# EAGLE design BG LWOC 2.1 (EAGLE 9.6.2)

## Sheet 1 of 4: POWER + HARDWARE
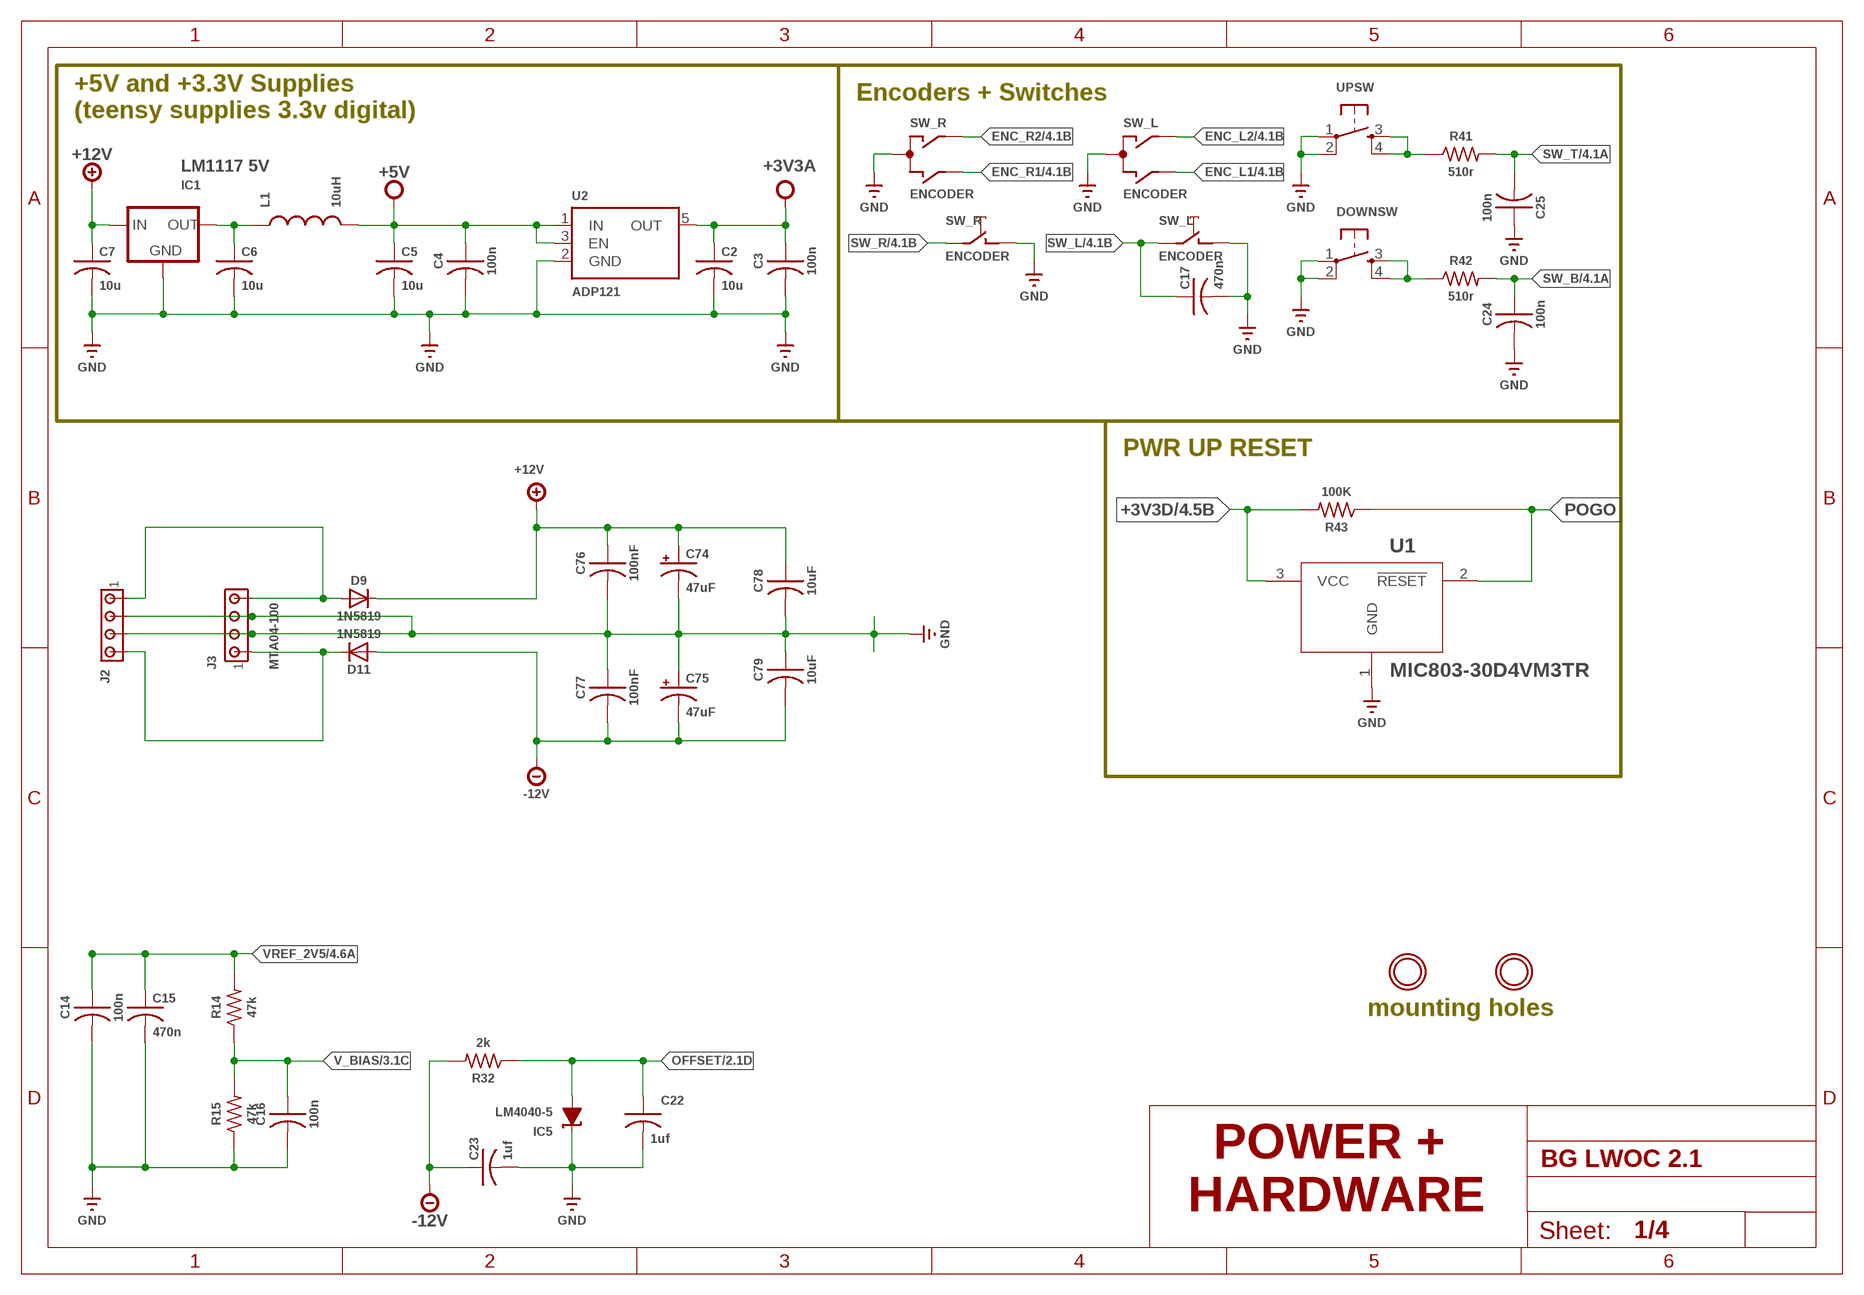
[diagram p0: schematic, sheet 1]

### Parts
C2  10u  C-USC1206K  [C1206K]
C3  100n  RCL_C-USC0603K  [RCL_C0603K]
C4  100n  RCL_C-USC0603K  [RCL_C0603K]
C5  10u  C-USC1206K  [C1206K]
C6  10u  C-USC1206K  [C1206K]
C7  10u  C-USC1206K  [C1206K]
C14  100n  RCL_C-USC0603K  [RCL_C0603K]
C15  470n  RCL_C-USC0603K  [RCL_C0603K]
C16  100n  RCL_C-USC0603K  [RCL_C0603K]
C17  470n  C-USC0805K  [C0805K]
C22  1uf  C-USC0805K  [C0805K]
C23  1uf  C-USC0805K  [C0805K]
C24  100n  RCL_C-USC0603K  [RCL_C0603K]
C25  100n  RCL_C-USC0603K  [RCL_C0603K]
C74  47uF  RCL_CPOL-USE2.5-6  [RCL_E2,5-6]
C75  47uF  RCL_CPOL-USE2.5-6  [RCL_E2,5-6]
C76  100nF  RCL_C-USC0603K  [RCL_C0603K]
C77  100nF  RCL_C-USC0603K  [RCL_C0603K]
C78  10uF  RCL_C-USC1210  [RCL_C1210]
C79  10uF  RCL_C-USC1210  [RCL_C1210]
D9  1N5819  DIODE_DIODE-SOD323-W  [DIODE_SOD323-W]
D11  1N5819  DIODE_DIODE-SOD323-W  [DIODE_SOD323-W]
DOWNSW  SPARKFUN_TAC_SWITCHPTH  [SPARKFUN_TACTILE-PTH]
IC1  LM1117 5V  LM1117TO252  [TO252]
IC5  LM4040-5  LM4041A12DBZ  [DBZ_R-PDSO-G3]
J2  MTA04-156  [1X4MTA]
J3  MTA04-100  [1X04MTA]
L1  10uH  INDUCTOR1210  [1210]
R14  47k  RCL_R-US_R0603  [RCL_R0603]
R15  47k  RCL_R-US_R0603  [RCL_R0603]
R32  2k  RCL_R-US_R0603  [RCL_R0603]
R41  510r  RCL_R-US_R0603  [RCL_R0603]
R42  510r  RCL_R-US_R0603  [RCL_R0603]
R43  100K  RCL_R-US_R0603  [RCL_R0603]
SW_L  ENCODER  OG-ENCODER_EC12E_SW  [OG-ENCODER_ALPS_EC12E_SW]
SW_R  ENCODER  OG-ENCODER_EC12E_SW  [OG-ENCODER_ALPS_EC12E_SW]
U1  MIC803-30D4VM3TR  [SOT95P232X110-3N]
U2  ADP121  [SOT23-5]
U$23  MOUNTINGHOLE2.5  [MOUNTINGHOLE_2.5_PLATED]
U$26  MOUNTINGHOLE2.5  [MOUNTINGHOLE_2.5_PLATED]
UPSW  SPARKFUN_TAC_SWITCHPTH  [SPARKFUN_TACTILE-PTH]

### Nets
+3V3A: C2.1 C3.1 U2.5(OUT) ; also sheet 2,4
+3V3D: R43.2 U1.3(VCC) ; also sheet 4
+5V: C4.1 C5.1 L1.2 U2.1(IN) U2.3(EN) ; also sheet 4
+12V: C7.1 C74.+ C76.1 C78.1 D9.C IC1.2(IN) ; also sheet 3
-12V: C23.1 C75.- C77.2 C79.2 D11.A R32.2 ; also sheet 3
ENC_L1: SW_L.B ; also sheet 4
ENC_L2: SW_L.A ; also sheet 4
ENC_R1: SW_R.B ; also sheet 4
ENC_R2: SW_R.A ; also sheet 4
GND: C2.2 C3.2 C4.2 C5.2 C6.2 C7.2 C14.2 C15.2 C16.2 C17.2 C22.2 C23.2 C24.2 C25.1 C74.- C75.+ C76.2 C77.1 C78.2 C79.1 DOWNSW.1 DOWNSW.2 IC1.1(GND) IC5.1(C) J2.2 J2.3 J3.2 J3.3 R15.1 SW_L.C SW_L.D SW_R.C SW_R.D U1.1(GND) U2.2(GND) UPSW.1 UPSW.2 ; also sheet 2,3,4
N$2: C6.1 IC1.3(OUT) L1.1
N$22: DOWNSW.3 DOWNSW.4 R42.1
N$26: R41.1 UPSW.3 UPSW.4
N$196: D11.C J2.4 J3.4
N$263: D9.A J2.1 J3.1
OFFSET: C22.1 IC5.2(A) R32.1 ; also sheet 2
POGO: R43.1 U1.2(!RESET!)
SW_B: C24.1 R42.2 ; also sheet 4
SW_L: C17.1 SW_L.E ; also sheet 4
SW_R: SW_R.E ; also sheet 4
SW_T: C25.2 R41.2 ; also sheet 4
V_BIAS: C16.1 R14.1 R15.2 ; also sheet 3
VREF_2V5: C14.1 C15.1 R14.2 ; also sheet 4
Unconnected: SW_L.GND1(G) SW_L.GND2(G) SW_R.GND1(G) SW_R.GND2(G)

### Notes on the sheet
- Encoders + Switches
- +5V and +3.3V Supplies
  (teensy supplies 3.3v digital)
- PWR UP RESET
- mounting holes
- POWER + 
  HARDWARE

## Sheet 2 of 4: INPUT STAGES
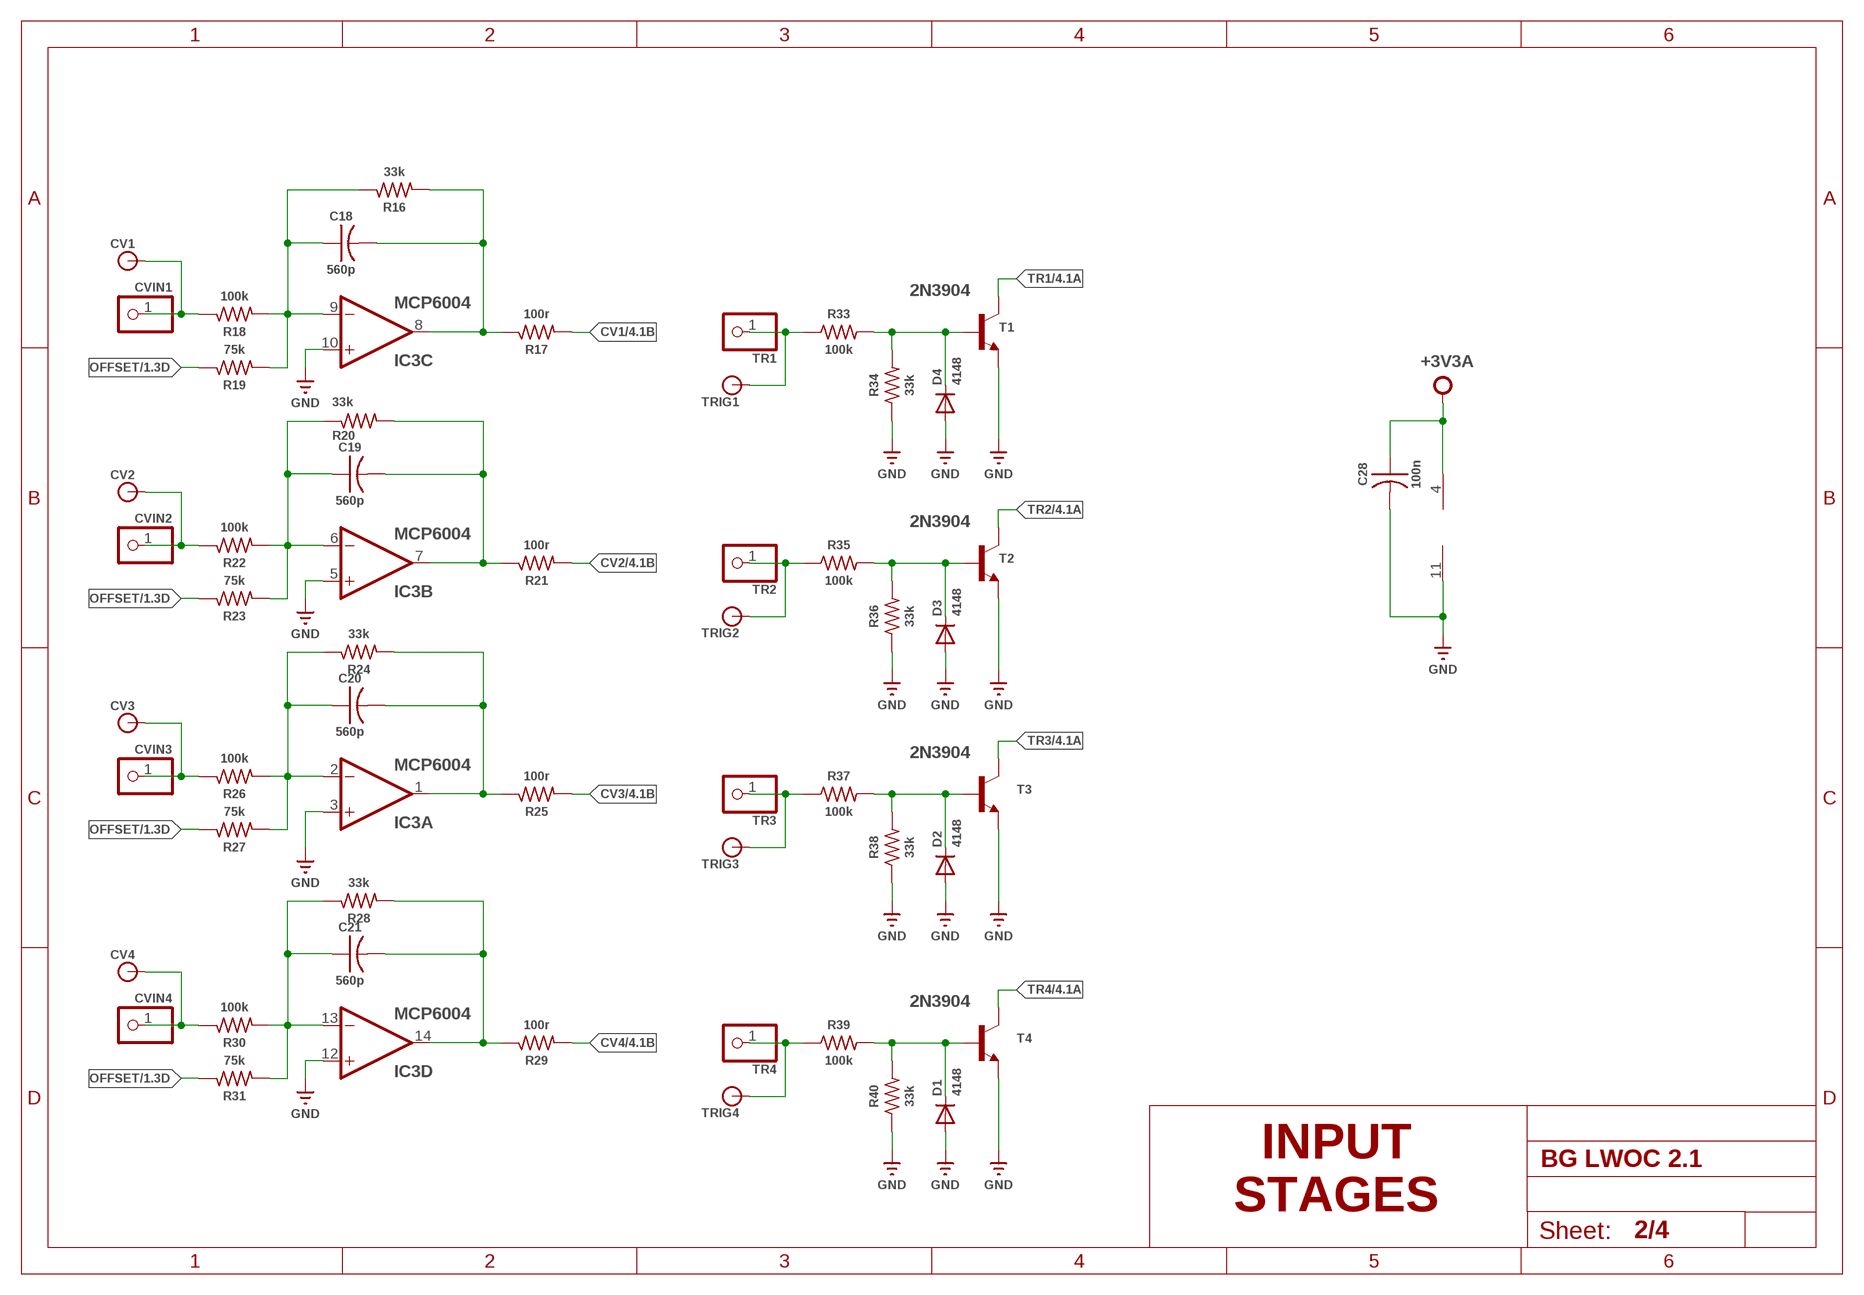
[diagram p1: schematic, sheet 2]

### Parts
C18  560p  RCL_C-USC0603K  [RCL_C0603K]
C19  560p  RCL_C-USC0603K  [RCL_C0603K]
C20  560p  RCL_C-USC0603K  [RCL_C0603K]
C21  560p  RCL_C-USC0603K  [RCL_C0603K]
C28  100n  RCL_C-USC0603K  [RCL_C0603K]
CV1  BANANA_CONN  [BANANA_CONN]
CV2  BANANA_CONN  [BANANA_CONN]
CV3  BANANA_CONN  [BANANA_CONN]
CV4  BANANA_CONN  [BANANA_CONN]
CVIN1  PINHD-1X1  [1X01]
CVIN2  PINHD-1X1  [1X01]
CVIN3  PINHD-1X1  [1X01]
CVIN4  PINHD-1X1  [1X01]
D1  4148  DIODE_DIODE-SOD323-W  [DIODE_SOD323-W]
D2  4148  DIODE_DIODE-SOD323-W  [DIODE_SOD323-W]
D3  4148  DIODE_DIODE-SOD323-W  [DIODE_SOD323-W]
D4  4148  DIODE_DIODE-SOD323-W  [DIODE_SOD323-W]
IC3  MCP6004  GM-ICS_TL074D  [GM-ICS_SO14]
R16  33k  RCL_R-US_R0603  [RCL_R0603]
R17  100r  RCL_R-US_R0603  [RCL_R0603]
R18  100k  RCL_R-US_R0603  [RCL_R0603]
R19  75k  RCL_R-US_R0603  [RCL_R0603]
R20  33k  RCL_R-US_R0603  [RCL_R0603]
R21  100r  RCL_R-US_R0603  [RCL_R0603]
R22  100k  RCL_R-US_R0603  [RCL_R0603]
R23  75k  RCL_R-US_R0603  [RCL_R0603]
R24  33k  RCL_R-US_R0603  [RCL_R0603]
R25  100r  RCL_R-US_R0603  [RCL_R0603]
R26  100k  RCL_R-US_R0603  [RCL_R0603]
R27  75k  RCL_R-US_R0603  [RCL_R0603]
R28  33k  RCL_R-US_R0603  [RCL_R0603]
R29  100r  RCL_R-US_R0603  [RCL_R0603]
R30  100k  RCL_R-US_R0603  [RCL_R0603]
R31  75k  RCL_R-US_R0603  [RCL_R0603]
R33  100k  RCL_R-US_R0603  [RCL_R0603]
R34  33k  RCL_R-US_R0603  [RCL_R0603]
R35  100k  RCL_R-US_R0603  [RCL_R0603]
R36  33k  RCL_R-US_R0603  [RCL_R0603]
R37  100k  RCL_R-US_R0603  [RCL_R0603]
R38  33k  RCL_R-US_R0603  [RCL_R0603]
R39  100k  RCL_R-US_R0603  [RCL_R0603]
R40  33k  RCL_R-US_R0603  [RCL_R0603]
T1  2N3904  TRANSISTOR_MMBT3904LT1-NPN-SOT23-BEC  [TRANSISTOR_SOT23-BEC]
T2  2N3904  TRANSISTOR_MMBT3904LT1-NPN-SOT23-BEC  [TRANSISTOR_SOT23-BEC]
T3  2N3904  TRANSISTOR_MMBT3904LT1-NPN-SOT23-BEC  [TRANSISTOR_SOT23-BEC]
T4  2N3904  TRANSISTOR_MMBT3904LT1-NPN-SOT23-BEC  [TRANSISTOR_SOT23-BEC]
TR1  PINHD-1X1  [1X01]
TR2  PINHD-1X1  [1X01]
TR3  PINHD-1X1  [1X01]
TR4  PINHD-1X1  [1X01]
TRIG1  BANANA_CONN  [BANANA_CONN]
TRIG2  BANANA_CONN  [BANANA_CONN]
TRIG3  BANANA_CONN  [BANANA_CONN]
TRIG4  BANANA_CONN  [BANANA_CONN]

### Nets
+3V3A: C28.1 IC3.4(P:V+) ; also sheet 1,4
CV1: R17.2 ; also sheet 4
CV2: R21.2 ; also sheet 4
CV3: R25.2 ; also sheet 4
CV4: R29.2 ; also sheet 4
GND: C28.2 D1.A D2.A D3.A D4.A IC3.3(A:+IN) IC3.5(B:+IN) IC3.10(C:+IN) IC3.11(P:V-) IC3.12(D:+IN) R34.1 R36.1 R38.1 R40.1 T1.E T2.E T3.E T4.E ; also sheet 1,3,4
N$1: C18.2 IC3.8(C:OUT) R16.2 R17.1
N$4: CV1.P$1 CVIN1.1 R18.1
N$5: R39.1 TR4.1 TRIG4.P$1
N$9: C18.1 IC3.9(C:-IN) R16.1 R18.2 R19.2
N$11: R33.1 TR1.1 TRIG1.P$1
N$15: CV2.P$1 CVIN2.1 R22.1
N$17: C19.1 IC3.6(B:-IN) R20.1 R22.2 R23.2
N$20: C19.2 IC3.7(B:OUT) R20.2 R21.1
N$23: CV3.P$1 CVIN3.1 R26.1
N$24: C20.1 IC3.2(A:-IN) R24.1 R26.2 R27.2
N$25: C20.2 IC3.1(A:OUT) R24.2 R25.1
N$27: CV4.P$1 CVIN4.1 R30.1
N$28: C21.1 IC3.13(D:-IN) R28.1 R30.2 R31.2
N$29: C21.2 IC3.14(D:OUT) R28.2 R29.1
N$31: R35.1 TR2.1 TRIG2.P$1
N$33: D2.C R37.2 R38.2 T3.B
N$34: R37.1 TR3.1 TRIG3.P$1
N$38: D1.C R39.2 R40.2 T4.B
N$40: D3.C R35.2 R36.2 T2.B
N$41: D4.C R33.2 R34.2 T1.B
OFFSET: R19.1 R23.1 R27.1 R31.1 ; also sheet 1
TR1: T1.C ; also sheet 4
TR2: T2.C ; also sheet 4
TR3: T3.C ; also sheet 4
TR4: T4.C ; also sheet 4

### Notes on the sheet
- INPUT
  STAGES

## Sheet 3 of 4: OUTPUT STAGES
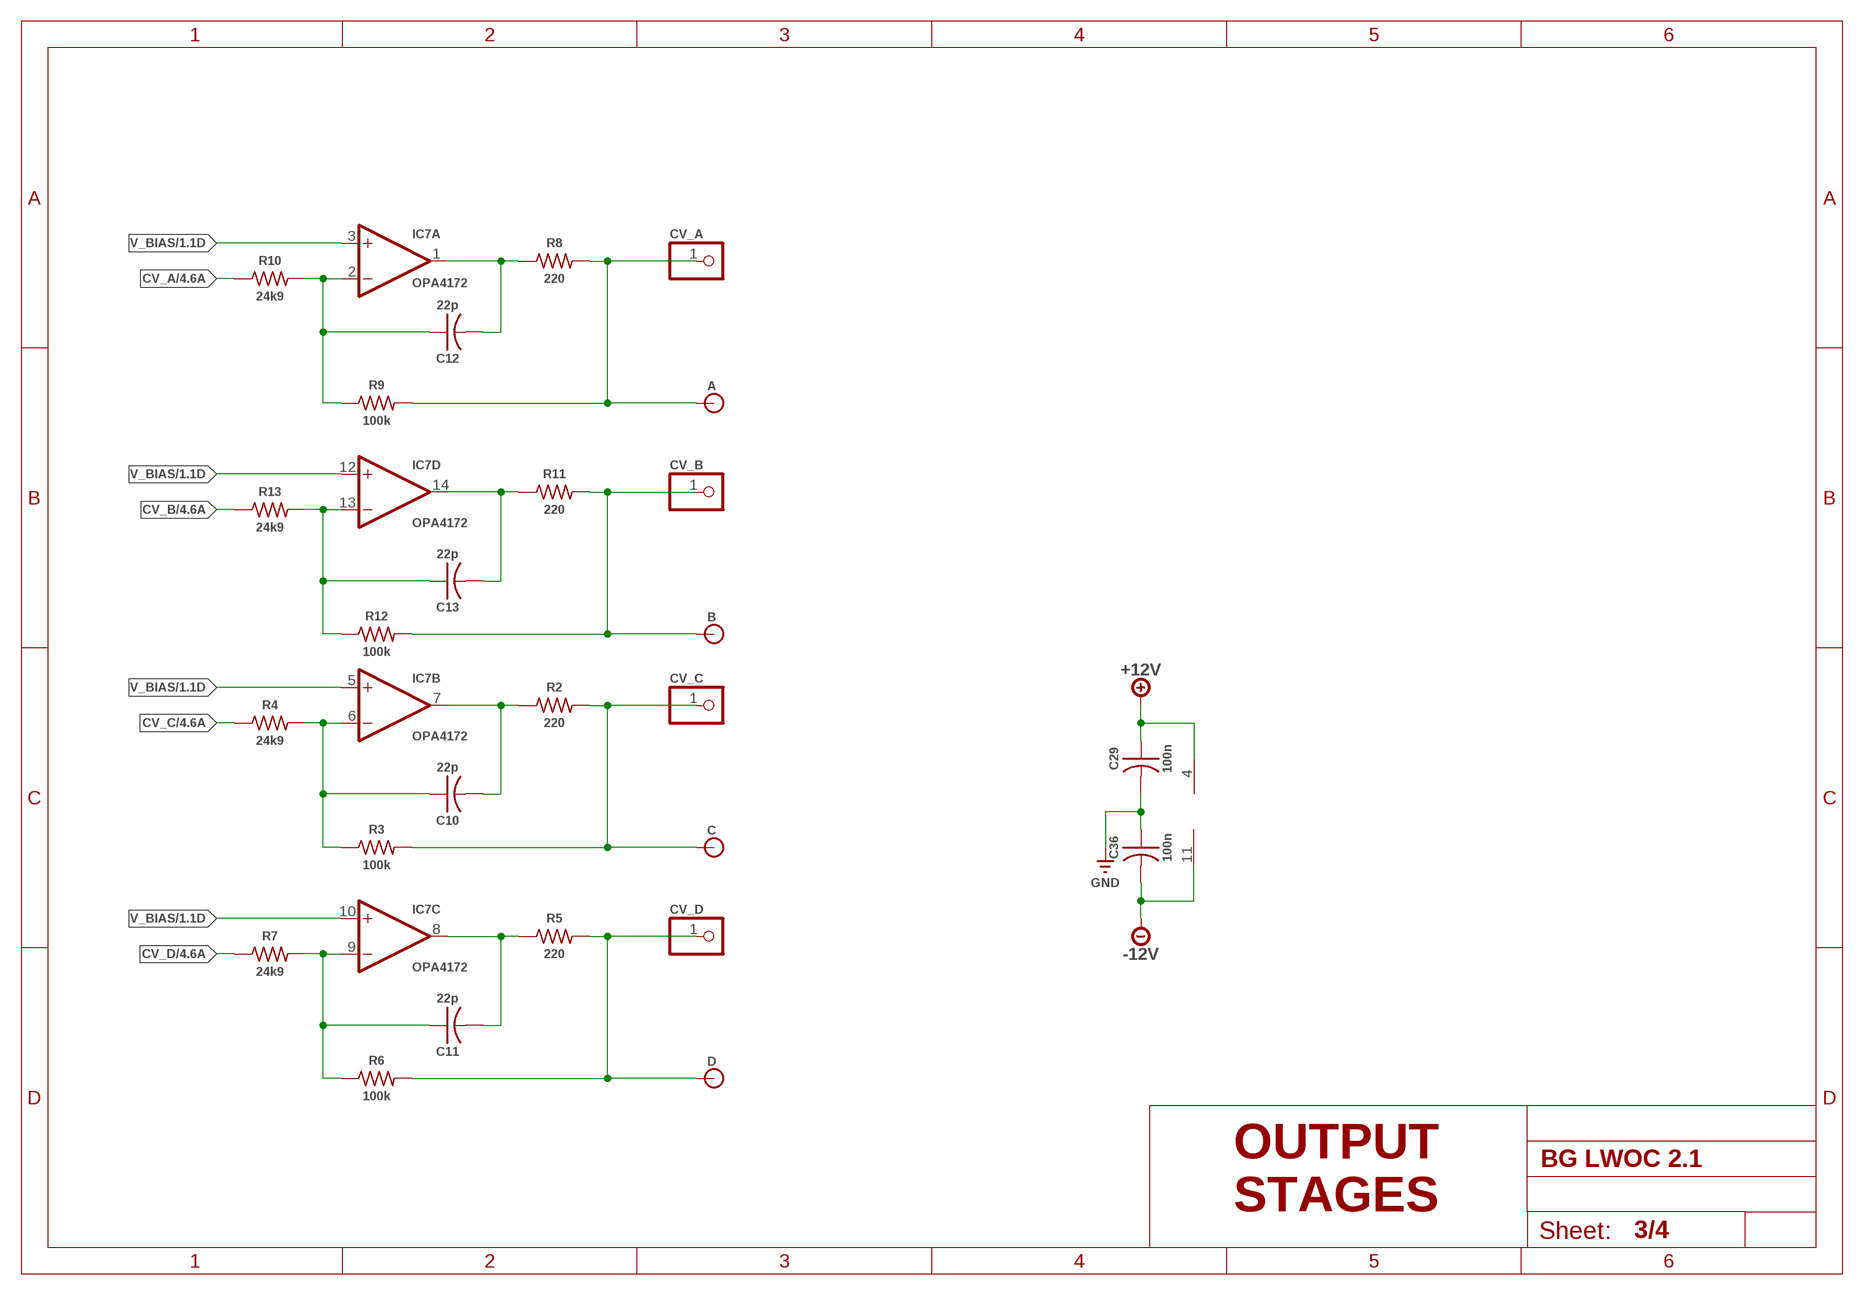
[diagram p2: schematic, sheet 3]

### Parts
A  BANANA_CONN  [BANANA_CONN]
B  BANANA_CONN  [BANANA_CONN]
C  BANANA_CONN  [BANANA_CONN]
C10  22p  RCL_C-USC0603K  [RCL_C0603K]
C11  22p  RCL_C-USC0603K  [RCL_C0603K]
C12  22p  RCL_C-USC0603K  [RCL_C0603K]
C13  22p  RCL_C-USC0603K  [RCL_C0603K]
C29  100n  RCL_C-USC0603K  [RCL_C0603K]
C36  100n  RCL_C-USC0603K  [RCL_C0603K]
CV_A  PINHD-1X1  [1X01]
CV_B  PINHD-1X1  [1X01]
CV_C  PINHD-1X1  [1X01]
CV_D  PINHD-1X1  [1X01]
D  BANANA_CONN  [BANANA_CONN]
IC7  OPA4172  GM-ICS_TL074D  [GM-ICS_SO14]
R2  220  RCL_R-US_R0603  [RCL_R0603]
R3  100k  RCL_R-US_R0603  [RCL_R0603]
R4  24k9  RCL_R-US_R0603  [RCL_R0603]
R5  220  RCL_R-US_R0603  [RCL_R0603]
R6  100k  RCL_R-US_R0603  [RCL_R0603]
R7  24k9  RCL_R-US_R0603  [RCL_R0603]
R8  220  RCL_R-US_R0603  [RCL_R0603]
R9  100k  RCL_R-US_R0603  [RCL_R0603]
R10  24k9  RCL_R-US_R0603  [RCL_R0603]
R11  220  RCL_R-US_R0603  [RCL_R0603]
R12  100k  RCL_R-US_R0603  [RCL_R0603]
R13  24k9  RCL_R-US_R0603  [RCL_R0603]

### Nets
+12V: C29.1 IC7.4(P:V+) ; also sheet 1
-12V: C36.2 IC7.11(P:V-) ; also sheet 1
CV_A: R10.1 ; also sheet 4
CV_B: R13.1 ; also sheet 4
CV_C: R4.1 ; also sheet 4
CV_D: R7.1 ; also sheet 4
GND: C29.2 C36.1 ; also sheet 1,2,4
N$3: C10.1 IC7.6(B:-IN) R3.1 R4.2
N$6: C10.2 IC7.7(B:OUT) R2.1
N$7: C11.1 IC7.9(C:-IN) R6.1 R7.2
N$8: A.P$1 CV_A.1 R8.2 R9.2
N$10: C11.2 IC7.8(C:OUT) R5.1
N$12: C12.1 IC7.2(A:-IN) R9.1 R10.2
N$16: C12.2 IC7.1(A:OUT) R8.1
N$18: C13.1 IC7.13(D:-IN) R12.1 R13.2
N$19: C.P$1 CV_C.1 R2.2 R3.2
N$21: C13.2 IC7.14(D:OUT) R11.1
N$30: B.P$1 CV_B.1 R11.2 R12.2
N$32: CV_D.1 D.P$1 R5.2 R6.2
V_BIAS: IC7.3(A:+IN) IC7.5(B:+IN) IC7.10(C:+IN) IC7.12(D:+IN) ; also sheet 1

### Notes on the sheet
- OUTPUT
  STAGES

## Sheet 4 of 4: TEENSY DAC and OLED
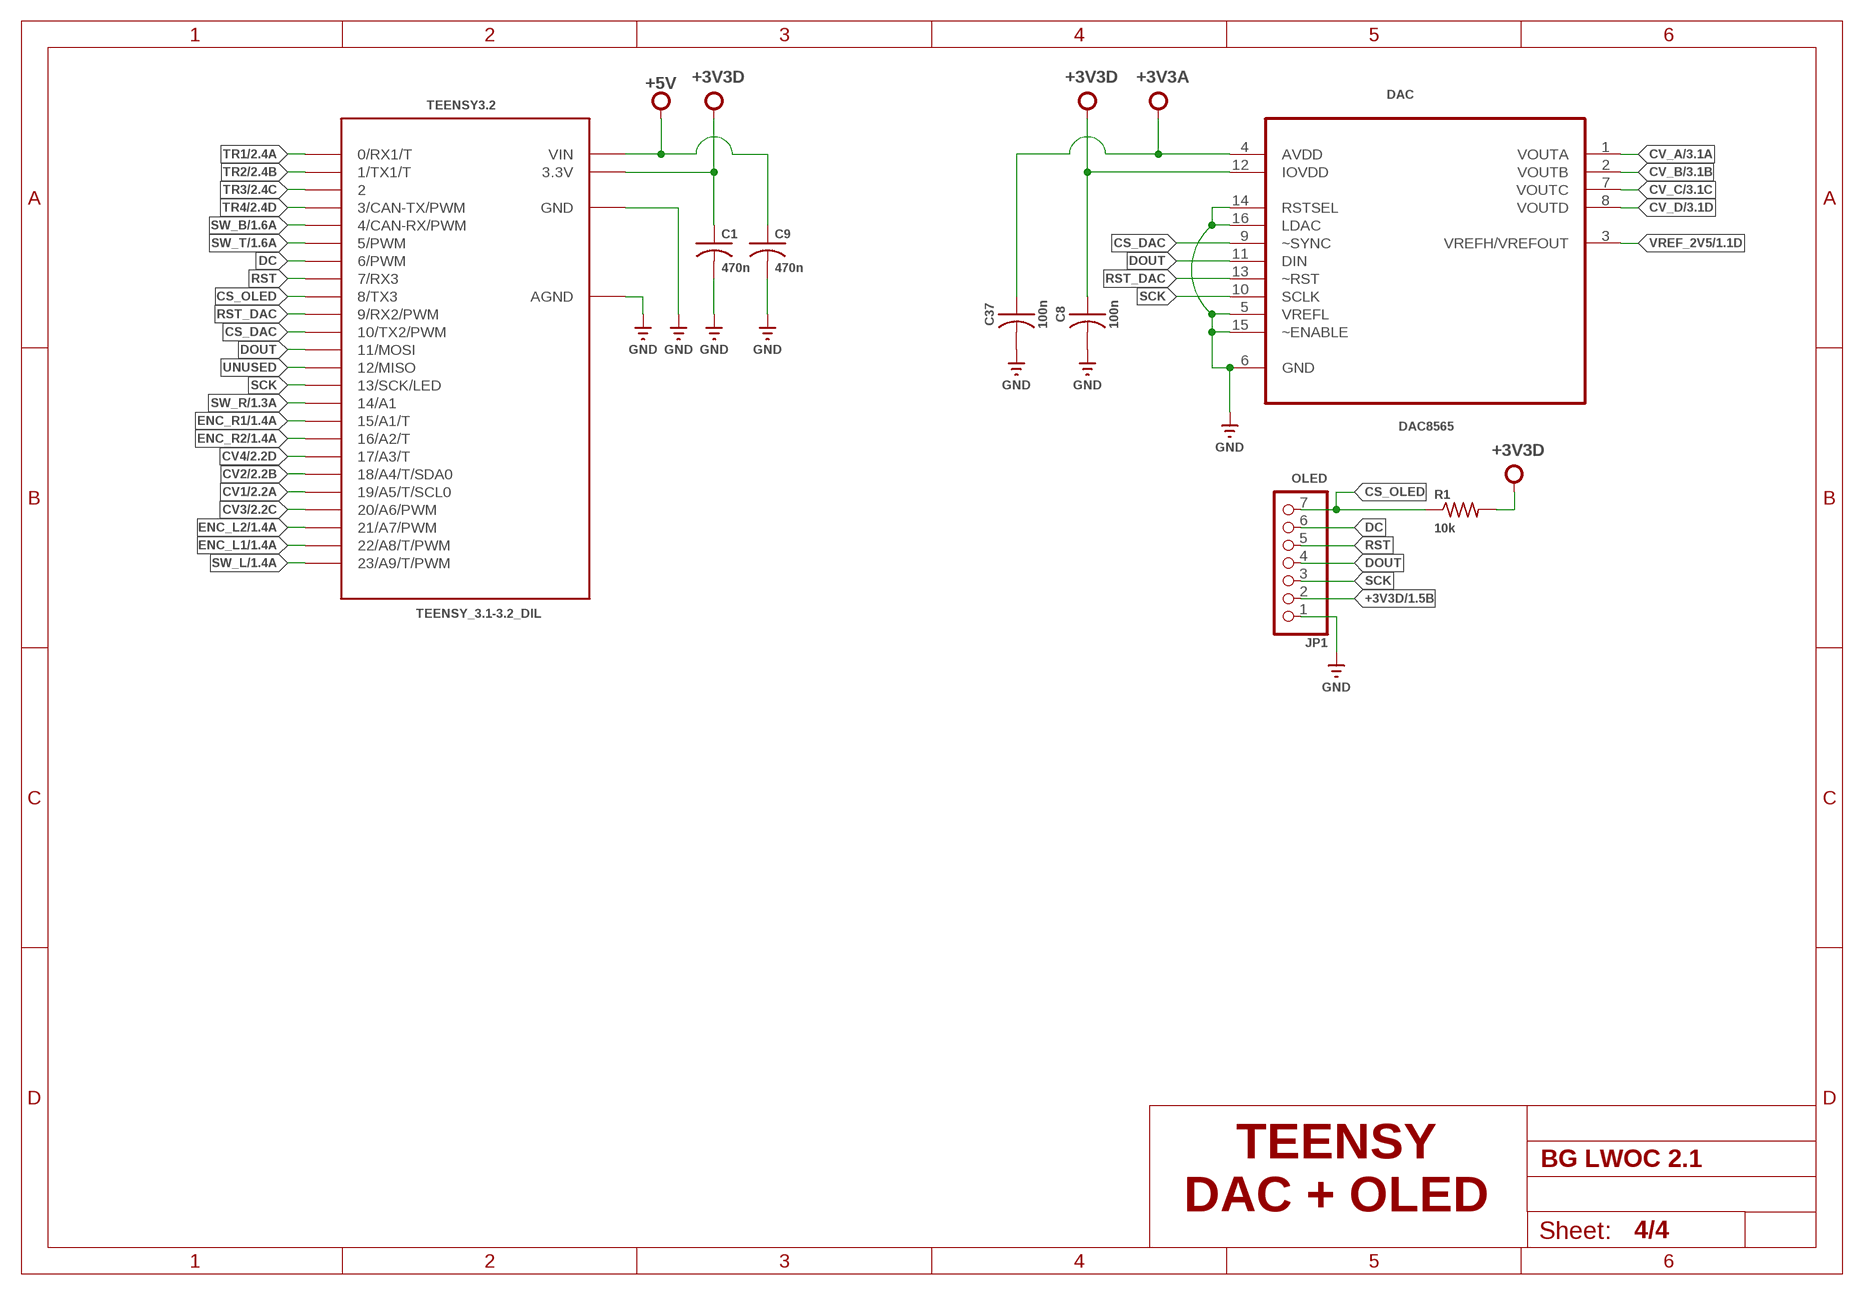
[diagram p3: schematic, sheet 4]

### Parts
C1  470n  C-USC0805K  [C0805K]
C8  100n  RCL_C-USC0603K  [RCL_C0603K]
C9  470n  C-USC0805K  [C0805K]
C37  100n  RCL_C-USC0603K  [RCL_C0603K]
DAC  DAC8565  DAC8565IAPW  [SOP65P640X120-16N]
JP1  OLED  PINHD-1X7  [1X07]
R1  10k  R-US_M0805  [M0805]
TEENSY3.2  TEENSY_3.1-3.2_DIL  [TEENSY_3.0-3.2&LC_DIL]

### Nets
+3V3A: C37.1 DAC.4(AVDD) ; also sheet 1,2
+3V3D: C1.1 C8.1 DAC.12(IOVDD) JP1.2 R1.2 TEENSY3.2.3.3V ; also sheet 1
+5V: C9.1 TEENSY3.2.VIN ; also sheet 1
CS_DAC: DAC.9(~SYNC) TEENSY3.2.10(10/TX2/PWM)
CS_OLED: JP1.7 R1.1 TEENSY3.2.8(8/TX3)
CV1: TEENSY3.2.19/A5(19/A5/T/SCL0) ; also sheet 2
CV2: TEENSY3.2.18/A4(18/A4/T/SDA0) ; also sheet 2
CV3: TEENSY3.2.20/A6(20/A6/PWM) ; also sheet 2
CV4: TEENSY3.2.17/A3(17/A3/T) ; also sheet 2
CV_A: DAC.1(VOUTA) ; also sheet 3
CV_B: DAC.2(VOUTB) ; also sheet 3
CV_C: DAC.7(VOUTC) ; also sheet 3
CV_D: DAC.8(VOUTD) ; also sheet 3
DC: JP1.6 TEENSY3.2.6(6/PWM)
DOUT: DAC.11(DIN) JP1.4 TEENSY3.2.11(11/MOSI)
ENC_L1: TEENSY3.2.22/A8(22/A8/T/PWM) ; also sheet 1
ENC_L2: TEENSY3.2.21/A7(21/A7/PWM) ; also sheet 1
ENC_R1: TEENSY3.2.15/A1(15/A1/T) ; also sheet 1
ENC_R2: TEENSY3.2.16/A2(16/A2/T) ; also sheet 1
GND: C1.2 C8.2 C9.2 C37.2 DAC.5(VREFL) DAC.6(GND) DAC.14(RSTSEL) DAC.15(~ENABLE) DAC.16(LDAC) JP1.1 TEENSY3.2.AGND TEENSY3.2.GND ; also sheet 1,2,3
RST: JP1.5 TEENSY3.2.7(7/RX3)
RST_DAC: DAC.13(~RST) TEENSY3.2.9(9/RX2/PWM)
SCK: DAC.10(SCLK) JP1.3 TEENSY3.2.13(13/SCK/LED)
SW_B: TEENSY3.2.4(4/CAN-RX/PWM) ; also sheet 1
SW_L: TEENSY3.2.23/A9(23/A9/T/PWM) ; also sheet 1
SW_R: TEENSY3.2.14/A0(14/A1) ; also sheet 1
SW_T: TEENSY3.2.5(5/PWM) ; also sheet 1
TR1: TEENSY3.2.0(0/RX1/T) ; also sheet 2
TR2: TEENSY3.2.1(1/TX1/T) ; also sheet 2
TR3: TEENSY3.2.2 ; also sheet 2
TR4: TEENSY3.2.3(3/CAN-TX/PWM) ; also sheet 2
UNUSED: TEENSY3.2.12(12/MISO)
VREF_2V5: DAC.3(VREFH/VREFOUT) ; also sheet 1

### Notes on the sheet
- TEENSY
  DAC + OLED

## Library data of the parts
A B C CV1-CV4 D TRIG1-TRIG4 = SparkFun-Connectors:BANANA_CONN: Through-hole Banana Jack Basic PTH connection for banana jack plugs SparkFun Products: Multimeter Kit <https://www.sparkfun.com/products/retired/10956> Banana to Alligator Cable <https://www.sparkfun.com/products/retired/509> Banana to Alligator Coax Cable <https://www.sparkfun.com/products/retired/508> Banana to Banana Cable <https://www.sparkfun.com/products/retired/507> Banana to IC Hook Cables <https://www.sparkfun.com/products/retired/506>
C1 C2 C5-C7 C9 C17 C22 C23 = elements_v02:C-US: CAPACITOR, American symbol
C3 C4 C8 C10-C16 C18-C21 C24 C25 C28 C29 C36 C37 C78 C79 = clouds_v30:RCL_C-US: CAPACITOR, American symbol
C74 C75 = ripples_v40:RCL_CPOL-US: POLARIZED CAPACITOR, American symbol
C76 C77 = ripples_v40:RCL_C-US: CAPACITOR, American symbol
CV_A CV_B CV_C CV_D CVIN1-CVIN4 TR1-TR4 = pinhead:PINHD-1X1: PIN HEADER
D1-D4 = clouds_v30:DIODE_DIODE-: DIODE
D9 D11 = ripples_v40:DIODE_DIODE-: DIODE
DAC = DAC8565IAPW:DAC8565IAPW: Quad Channel DAC; AVAILABILITY: Good; DESCRIPTION: 16-Bit, Quad Channel, Ultra-Low Glitch, Voltage Output DAC with 2.5V, 2ppm/C Internal eference 16-TSSOP -40 to 105; MF: Texas Instruments; MP: DAC8565IAPW; PACKAGE: TSSOP-16 Texas Instruments; PRICE: 11.99 USD
DOWNSW UPSW = clouds_v30:SPARKFUN_TAC_SWITCH: Momentary Switch Button commonly used for reset or general input. Spark Fun Electronics SKU : COM-00097
IC1 = v-reg-2:LM1117
IC3 IC7 = clouds_v30:GM-ICS_TL074: OP AMP
IC5 = elements_v02:LM4041: PRECISION MICROPOWER SHUNT VOLTAGE REFERENCE Source: http://focus.ti.com/lit/ds/slcs146e/slcs146e.pdf
J2 = con-amp:MTA04-156: AMP connector
J3 = AMP_MTA:MTA04-100
JP1 = pinhead:PINHD-1X7: PIN HEADER
L1 = Icotech_Eagle_Library:INDUCTOR: Inductors Basic Inductor/Choke - 0603 and 1206. Footprints are not proven and vary greatly between part numbers.
R1 = elements_v02:R-US_: RESISTOR, American symbol
R2-R43 = clouds_v30:RCL_R-US_: RESISTOR, American symbol
SW_L SW_R = braids_v50:OG-ENCODER_EC12E_SW: ALPS rotary Encoder EC12E series with switch
T1-T4 = braids_v50:TRANSISTOR_*-NPN-: NPN Transistror BF959 corrected 2008.03.06
TEENSY3.2 = Teensy_3_and_LC_Series_Boards_v1.4:TEENSY_3.1-3.2_DIL: Teensy 3.1 or 3.2 in a DIL Layout.
U1 = Micrel_By_element14_Batch_1:MIC803-30D4VM3TR: 3 Pin Microprocessor Supervisor Circuit; MPN: MIC803-30D4VM3TR; OC_FARNELL: 1924769; OC_NEWARK: 58T4951; PACKAGE: SOT-23-3; SUPPLIER: MICREL SEMICONDUCTOR
U2 = microbuilder:ADP121: LDO Fixed Voltage Regulator 150mA The ADP121 voltage regulator is ideal for regulating battery or solar power due to it's very low foreward voltage drop (maximum 90mV at 150mA). Forward Voltage Dropout: 90mV at 150mA Input Voltage Range: 2.3V-5.5V Output Voltage Range: 1.2V-3.3V (depending on model) Digikey: 3.3V - ADP121-AUJZ33R7CT-ND Digikey: 3.0V - ADP121-AUJZ30R7CT-ND
U$23 U$26 = microbuilder:MOUNTINGHOLE: Mounting Hole For #2 screws (0.086"/2.18mm width, 0.094"/2.4mm hole) use 2.5mm

## Board
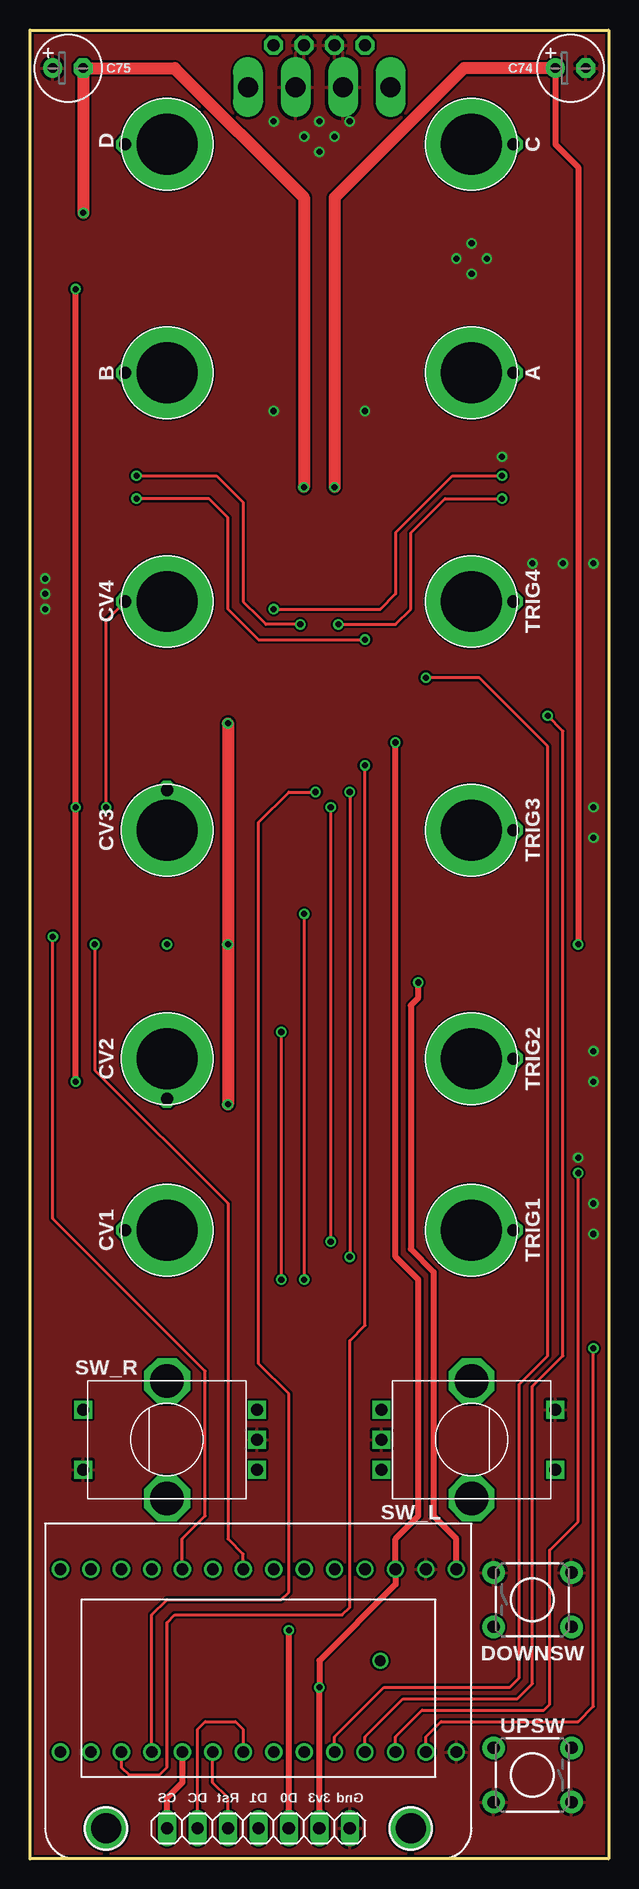
[diagram p4: board, top side]
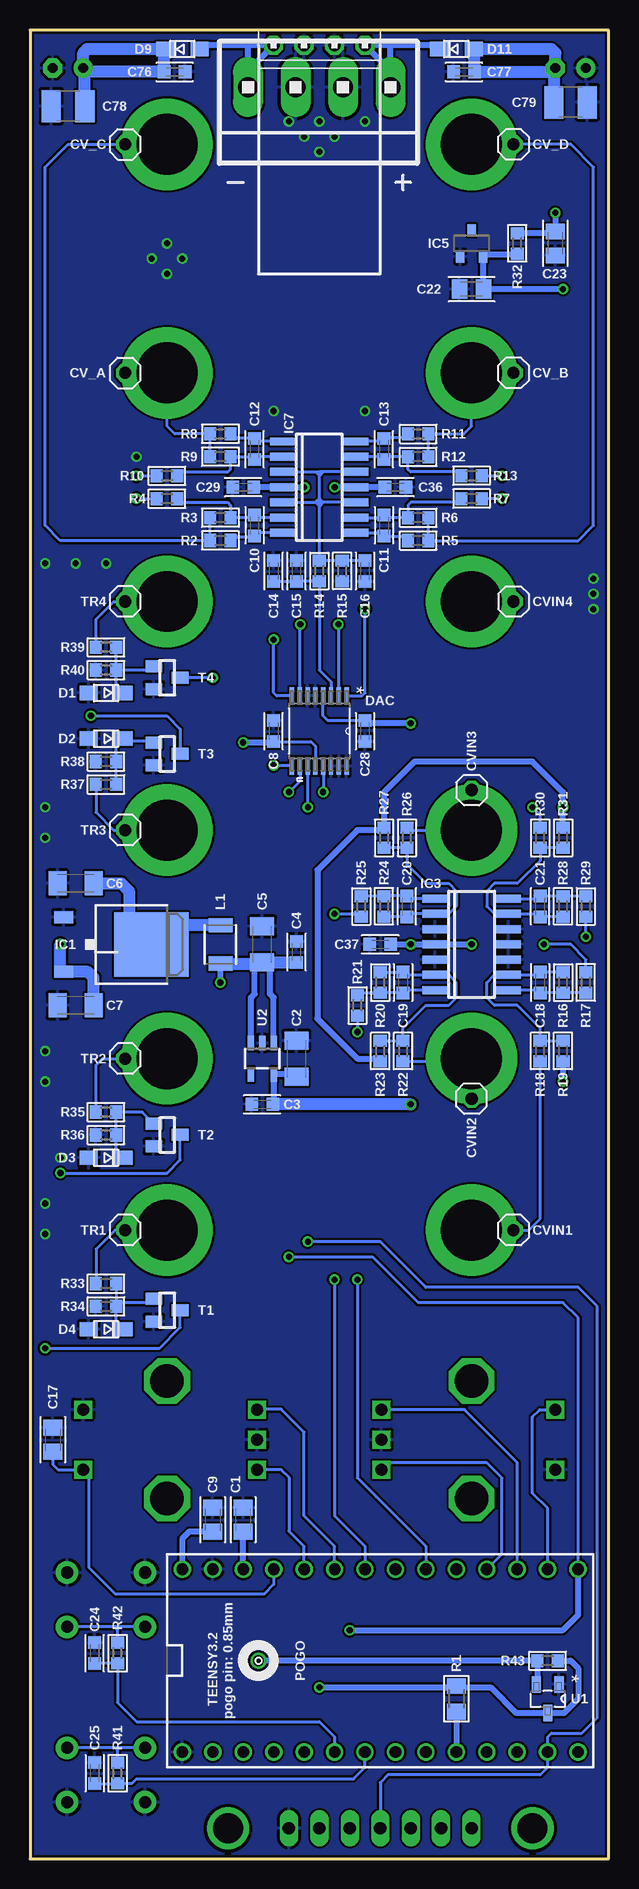
[diagram p5: board, bottom side, seen from below]

Size 48.26 x 152.4 mm. Coordinates in mm from the lower left corner, seen from the top.
Outline: 0,152.4 48.26,152.4 48.26,0 0,0 0,152.4
Copper layers (1*16): Top 0.035mm / dielectric 1.5mm / Bottom 0.035mm
Design rules "SparkFun-2-layer-TIGHT": minimum track width 7mil, minimum drill 15mil, track to track 7mil, track to pad 7mil, pad to pad 7mil, via to via 7mil, smd to smd 7mil, copper to edge 7mil, drill to drill 7mil, minimum pad ring 7mil, minimum via ring 7mil, stop-mask expansion 4mil, vias tented up to drill 25mil, thermal gap 10mil

### Footprints (pad centres in the part's own frame; a part is rotated, then mirrored left to right if it is on the bottom)
BANANA_CONN = drill 5.08 pad 7.62: P$1 0,0
C0805K = smd 1.3 x 1.6: 1 -1,0; 2 1,0
C1206K = smd 1.5 x 2: 1 -1.5,0; 2 1.5,0
RCL_C0603K = smd 1.05 x 1.08: 1 -0.875,0; 2 0.875,0
RCL_E2,5-6 = drill 0.813 pad 1.6: + -1.27,0 | drill 0.813 pad 1.6 octagon: - 1.27,0
RCL_C1210 = smd 1.6 x 2.7: 1 -1.4,0; 2 1.4,0
1X01 = drill 1.016 octagon: 1 0,0
DIODE_SOD323-W = smd 1.5 x 1.2: A 1.45,0; C -1.45,0
SOP65P640X120-16N = smd 1.473 x 0.356: 1 -2.921,2.286; 2 -2.921,1.626; 3 -2.921,0.965; 4 -2.921,0.33; 5 -2.921,-0.33; 6 -2.921,-0.965; 7 -2.921,-1.626; 8 -2.921,-2.286; 9 2.921,-2.286; 10 2.921,-1.626; 11 2.921,-0.965; 12 2.921,-0.33; 13 2.921,0.33; 14 2.921,0.965; 15 2.921,1.626; 16 2.921,2.286
SPARKFUN_TACTILE-PTH = drill 1.016 pad 1.88: 1 -3.251,2.261; 2 3.251,2.261; 3 -3.251,-2.261; 4 3.251,-2.261
TO252 = smd 1 x 1.6: 1 -2.28,-6.07; 2 2.28,-6.07 | smd 5.4 x 6.2: 3 0,1.23
GM-ICS_SO14 = smd 0.66 x 2.032: 1 -3.81,-3.073; 2 -2.54,-3.073; 3 -1.27,-3.073; 4 0,-3.073; 5 1.27,-3.073; 6 2.54,-3.073; 7 3.81,-3.073; 8 3.81,3.073; 9 2.54,3.073; 10 1.27,3.073; 11 0,3.073; 12 -1.27,3.073; 13 -2.54,3.073; 14 -3.81,3.073
DBZ_R-PDSO-G3 = smd 0.7 x 1: 1 -0.95,-1.1; 2 0.95,-1.1; 3 0,1.1
1X4MTA = drill 1.676 long: 1 5.944,0; 2 1.981,0; 3 -1.981,0; 4 -5.944,0
1X04MTA = drill 1.016 pad 1.575 octagon: 1 3.81,0; 2 1.27,0; 3 -1.27,0; 4 -3.81,0
1X07 = drill 1.016 long: 1 -7.62,0; 2 -5.08,0; 3 -2.54,0; 4 0,0; 5 2.54,0; 6 5.08,0; 7 7.62,0
1210 = smd 1.2 x 2: 1 -1.6,0; 2 1.6,0
M0805 = smd 1.3 x 1.6: 1 -1.077,0; 2 1.077,0
RCL_R0603 = smd 1 x 1.1: 1 -0.85,0; 2 0.85,0
OG-ENCODER_ALPS_EC12E_SW = drill 1 square: A -2.5,-7.5; B 2.5,-7.5; C 0,-7.5; D -2.5,7; E 2.5,7 | drill 2.8 octagon: GND1 -4.9,0; GND2 4.9,0
TRANSISTOR_SOT23-BEC = smd 1 x 1.4: B -0.95,-1.1; C 0,1.1; E 0.95,-1.1
TEENSY_3.0-3.2&LC_DIL = drill 0.965: 0 -7.62,13.97; 1 -7.62,11.43; 2 -7.62,8.89; 3 -7.62,6.35; 3.3V 7.62,11.43; 4 -7.62,3.81; 5 -7.62,1.27; 6 -7.62,-1.27; 7 -7.62,-3.81; 8 -7.62,-6.35; 9 -7.62,-8.89; 10 -7.62,-11.43; 11 -7.62,-13.97; 12 -7.62,-16.51; 13 7.62,-16.51; 14/A0 7.62,-13.97; 15/A1 7.62,-11.43; 16/A2 7.62,-8.89; 17/A3 7.62,-6.35; 18/A4 7.62,-3.81; 19/A5 7.62,-1.27; 20/A6 7.62,1.27; 21/A7 7.62,3.81; 22/A8 7.62,6.35; 23/A9 7.62,8.89; AGND 7.62,13.97; GND -7.62,16.51; VIN 7.62,16.51
SOT95P232X110-3N = smd 1.397 x 0.762: 1 -1.194,0.94; 2 -1.194,-0.94; 3 1.194,0
SOT23-5 = smd 0.55 x 1.2: 1 -0.95,-1.3; 2 0,-1.3; 3 0.95,-1.3; 4 0.95,1.3; 5 -0.95,1.3
MOUNTINGHOLE_2.5_PLATED = drill 2.5 pad 3.2: P$1 0,0

### Placement (x,y rotation side)
A  36.83,123.83 180 top
B  11.43,123.83 180 top
C  36.83,142.88 180 top
C1  30.48,28.26 90 bottom
C2  26.04,66.67 90 bottom
C3  28.89,62.87 180 bottom
C4  26.04,75.56 90 bottom
C5  28.89,76.2 90 bottom
C6  44.45,81.28 180 bottom
C7  44.45,71.12 180 bottom
C8  27.94,93.98 90 bottom
C9  33.02,28.26 90 bottom
C10  29.53,111.12 270 bottom
C11  18.73,111.12 270 bottom
C12  29.53,117.47 90 bottom
C13  18.73,117.47 90 bottom
C14  27.94,107.31 90 bottom
C15  26.04,107.31 90 bottom
C16  20.32,107.31 270 bottom
C17  46.36,34.93 90 bottom
C18  5.71,73.03 270 bottom
C19  17.14,73.03 270 bottom
C20  16.83,79.38 90 bottom
C21  5.71,79.38 90 bottom
C22  11.43,130.81 180 bottom
C23  4.45,134.62 270 bottom
C24  42.86,17.15 90 bottom
C25  42.86,7.14 270 bottom
C28  20.32,93.98 270 bottom
C29  30.48,114.3 180 bottom
C36  17.78,114.3 180 bottom
C37  19.05,76.2 180 bottom
C74  45.08,149.23 0 top
C75  3.18,149.23 0 top
C76  36.2,148.91 0 bottom
C77  12.06,148.91 0 bottom
C78  45.08,146.05 180 bottom
C79  3.18,146.37 180 bottom
CV1  11.43,52.39 180 top
CV2  11.43,66.67 180 top
CV3  11.43,85.73 180 top
CV4  11.43,104.78 180 top
CV_A  40.32,123.83 90 bottom
CV_B  7.94,123.83 270 bottom
CV_C  40.32,142.88 90 bottom
CV_D  7.94,142.88 270 bottom
CVIN1  7.94,52.39 270 bottom
CVIN2  11.43,63.34 180 bottom
CVIN3  11.43,89.06 0 bottom
CVIN4  7.94,104.78 0 bottom
D  11.43,142.88 180 top
D1  41.91,97.16 180 bottom
D2  41.91,93.34 180 bottom
D3  41.91,58.42 180 bottom
D4  41.91,44.13 180 bottom
D9  35.56,150.81 0 bottom
D11  12.7,150.81 0 bottom
DAC  24.13,93.98 270 bottom
DOWNSW  41.91,21.59 0 top
IC1  39.37,76.2 270 bottom
IC3  11.43,76.2 270 bottom
IC5  11.43,134.62 0 bottom
IC7  24.13,114.3 270 bottom
J2  24.13,147.64 180 bottom
J3  24.13,151.13 180 bottom
JP1  19.05,2.54 180 top
L1  32.38,76.2 270 bottom
R1  12.7,13.34 90 bottom
R2  32.38,109.86 180 bottom
R3  32.38,111.76 180 bottom
R4  36.83,113.35 0 bottom
R5  15.87,109.86 0 bottom
R6  15.87,111.76 0 bottom
R7  11.43,113.35 180 bottom
R8  32.38,118.75 180 bottom
R9  32.38,116.84 180 bottom
R10  36.83,115.25 0 bottom
R11  15.87,118.75 0 bottom
R12  15.87,116.84 0 bottom
R13  11.43,115.25 180 bottom
R14  24.13,107.31 270 bottom
R15  22.22,107.31 90 bottom
R16  3.81,73.03 270 bottom
R17  1.9,73.03 90 bottom
R18  5.71,67.31 90 bottom
R19  3.81,67.31 90 bottom
R20  19.05,73.03 270 bottom
R21  20.95,71.12 270 bottom
R22  17.14,67.31 90 bottom
R23  19.05,67.31 90 bottom
R24  18.73,79.38 90 bottom
R25  20.64,79.38 270 bottom
R26  16.83,85.09 270 bottom
R27  18.73,85.09 270 bottom
R28  3.81,79.38 90 bottom
R29  1.9,79.38 270 bottom
R30  5.71,85.09 270 bottom
R31  3.81,85.09 270 bottom
R32  7.62,134.62 90 bottom
R33  41.91,47.94 0 bottom
R34  41.91,46.04 0 bottom
R35  41.91,62.23 0 bottom
R36  41.91,60.33 0 bottom
R37  41.91,89.53 0 bottom
R38  41.91,91.44 0 bottom
R39  41.91,100.97 0 bottom
R40  41.91,99.06 0 bottom
R41  40.96,7.14 270 bottom
R42  40.96,17.15 270 bottom
R43  5.08,16.51 0 bottom
SW_L  36.83,34.93 270 top
SW_R  11.43,34.93 90 top
T1  36.83,45.72 270 bottom
T2  36.83,60.33 270 bottom
T3  36.83,92.08 270 bottom
T4  36.83,98.43 270 bottom
TEENSY3.2  19.05,16.51 90 bottom
TR1  40.32,52.39 270 bottom
TR2  40.32,66.67 270 bottom
TR3  40.32,85.73 270 bottom
TR4  40.32,104.78 270 bottom
TRIG1  36.83,52.39 180 top
TRIG2  36.83,66.67 180 top
TRIG3  36.83,85.73 180 top
TRIG4  36.83,104.78 180 top
U1  5.08,13.34 270 bottom
U2  28.89,66.67 180 bottom
U$23  6.35,2.54 180 top
U$26  31.75,2.54 180 top
UPSW  41.91,6.98 180 top

### Tracks (layer width: path | path; a pad name or v marks a point on that pad's centre or on a via)
+3V3A  (via drill 0.51)
  Top 1.016: v16.51,94.62 v16.51,76.2 v16.51,62.87
  Bottom 0.254: C28.1 23.42,94.86 23.81,95.25 23.81,96.89 DAC.4
  Bottom 0.508: v11.43,76.2 IC3.4 v16.51,76.2 C37.1 | C3.1 27.94,62.94 U2.5 26.23,65.38 C2.1 | v16.51,94.62 20.08,94.62 C28.1
  Bottom 1.016: v16.51,62.87 C3.1
+3V3D  (via drill 0.51)
  Top 0.508: JP1.2 v24.13,14.29 24.13,16.51 30.48,22.86 TEENSY3.2.3.3V 30.48,26.67 32.38,28.58 32.38,48.26 30.48,50.17 v30.48,93.03
  Bottom 0.254: C8.1 24.84,93.11 24.45,92.71 24.45,91.07 DAC.12
  Bottom 0.508: TEENSY3.2.3.3V C1.1 | v30.48,93.03 28.02,93.03 C8.1 | R43.2 3.18,16.51 2.54,15.88 2.54,13.34 3.73,12.14 U1.3 7.7,12.14 9.84,14.29 12.57,14.29 R1.2 12.82,14.29 v24.13,14.29
+5V  (via drill 0.51)
  Top 0.508: TEENSY3.2.VIN 35.56,26.67 33.66,28.58 33.66,48.9 31.75,50.8 31.75,71.12 32.38,71.75 v32.38,73.03
  Bottom 0.508: 29.53,74.7 C5.1 28.57,74.69 28.26,74.69 | 29.53,74.7 32.28,74.7 L1.2 v32.38,73.03 | C4.1 28.26,74.69 | C9.1 34.97,27.26 35.56,26.67 TEENSY3.2.VIN | U2.1 27.94,71.76 28.26,72.07 28.26,74.69 | U2.3 29.84,71.76 29.53,72.07 29.53,74.7
  Bottom 1.016: L1.2 28.99,74.6 C5.1 | C4.1 28.57,74.69
+12V  (via drill 0.51)
  Top 0.508: v45.72,76.2 45.72,140.97 43.81,142.88 C74.+
  Top 1.016: C74.+ 36.2,149.23 25.4,138.43 v25.4,114.3
  Bottom 0.508: C29.1 IC7.4 v25.4,114.3
  Bottom 1.016: C7.1 42.95,73.43 43.44,73.92 IC1.2 45.72,74.2 v45.72,76.2 | C78.1 43.69,149.09 C74.+ | C74.+ 43.5,148.91 C76.1 37.07,150.75 D9.C 43.5,150.81 43.81,150.5 C74.+
-12V  (via drill 0.51)
  Top 1.016: v22.85,114.3 22.85,138.44 12.06,149.23 C75.- v4.45,137.16
  Bottom 0.508: v22.85,114.3 IC7.11 C36.2 | R32.2 4.59,135.47 C23.1 v4.45,137.16
  Bottom 1.016: C75.- 4.57,149.09 C79.2 | C75.- 4.45,150.5 4.76,150.81 D11.A 11.19,150.75 C77.2 4.76,148.91 C75.-
CS_DAC  (via drill 0.51)
  Top 0.254: v27.94,91.12 27.94,44.45 26.67,43.18 26.67,41.91 26.67,20.96 26.04,20.32 12.06,20.32 11.43,19.69 11.43,7.62 10.79,6.98 8.25,6.98 7.62,7.62 TEENSY3.2.10
  Bottom 0.254: v27.94,91.12 26.48,91.12 DAC.9
CS_OLED
  Top 0.508: JP1.7 11.43,5.08 12.7,6.35 TEENSY3.2.8
  Bottom 0.508: R1.1 TEENSY3.2.8
CV1  (via drill 0.51)
  Top 0.254: TEENSY3.2.19/A5 17.78,25.4 16.51,26.67 16.51,54.61 5.4,65.72 v5.4,76.2
  Bottom 0.254: R17.2 1.9,74.93 3.18,76.2 v5.4,76.2
CV2  (via drill 0.51)
  Top 0.254: v20.95,68.9 v20.95,48.26
  Bottom 0.254: TEENSY3.2.18/A4 15.24,26.04 19.37,30.16 20.95,31.75 v20.95,48.26 | R21.2 v20.95,68.9
CV3  (via drill 0.51)
  Top 0.254: v22.86,78.74 v22.86,48.26
  Bottom 0.254: v22.86,78.74 20.85,78.74 R25.2 | TEENSY3.2.20/A6 20.32,26.04 22.86,28.58 v22.86,48.26
CV4  (via drill 0.51)
  Top 0.254: TEENSY3.2.17/A3 12.7,26.67 14.6,28.58 14.6,40.64 1.9,53.34 v1.9,76.84
  Bottom 0.254: v1.9,76.84 R29.2
CV_A  (via drill 0.51)
  Top 0.254: v39.37,115.25 35.24,115.25 30.48,110.49 30.48,105.41 29.21,104.14 v20.32,104.14
  Bottom 0.254: v39.37,115.25 R10.1 | DAC.1 20.57,96.9 20.32,97.16 v20.32,104.14
CV_B  (via drill 0.51)
  Top 0.254: v8.89,115.25 15.56,115.25 17.78,113.03 17.78,104.78 19.05,103.5 19.68,102.87 v22.54,102.87
  Bottom 0.254: R13.1 v8.89,115.25 | DAC.2 22.5,102.83 v22.54,102.87
CV_C  (via drill 0.51)
  Top 0.254: v39.37,113.35 34.61,113.35 31.75,110.49 31.75,104.14 30.48,102.87 v25.72,102.87
  Bottom 0.254: v39.37,113.35 R4.1 | DAC.7 25.76,102.83 v25.72,102.87
CV_D  (via drill 0.51)
  Top 0.254: v8.89,113.35 14.92,113.35 16.51,111.76 16.51,104.14 19.05,101.6 v27.94,101.6
  Bottom 0.254: 26.51,97 DAC.8 27.69,96.9 27.94,97.16 v27.94,101.6 | v8.89,113.35 R7.1
DC
  Top 0.254: JP1.6 13.97,10.8 14.6,11.43 17.14,11.43 17.78,10.8 TEENSY3.2.6
DOUT  (via drill 0.51)
  Top 0.254: v25.08,87.63 v25.08,51.44
  Bottom 0.254: DAC.11 25.09,87.64 v25.08,87.63 | v25.08,51.44 19.05,51.44 15.24,47.62 2.54,47.62 0.95,46.04 0.95,11.75 2.22,10.48 4.76,10.48 5.08,10.16 TEENSY3.2.11 5.08,7.62 5.71,6.98 18.41,6.98 19.05,6.35 JP1.4
ENC_L1
  Bottom 0.254: SW_L.B 27.3,32.43 26.67,31.79 26.67,27.3 25.4,26.04 TEENSY3.2.22/A8
ENC_L2
  Bottom 0.254: SW_L.A 29.29,37.47 27.3,37.47 25.4,35.56 25.4,28.58 22.86,26.04 TEENSY3.2.21/A7
ENC_R1
  Bottom 0.254: TEENSY3.2.15/A1 7.62,33.02 12.02,37.43 SW_R.B
ENC_R2
  Bottom 0.254: TEENSY3.2.16/A2 8.89,25.4 8.89,31.75 10.16,33.02 18.34,33.02 SW_R.A
GND  (via drill 0.51)
  other vias: 45.72,58.42 44.45,107.95 41.91,107.95 46.99,107.95 46.99,87.63 46.99,85.09 46.99,67.31 46.99,64.77 46.99,52.07 46.99,54.61 27.94,120.65 20.32,120.65 39.37,116.84 24.13,144.78 20.32,144.78 26.67,144.78 24.13,142.24 22.86,143.51 25.4,143.51 36.83,134.62 36.83,132.08 35.56,133.35 38.1,133.35 1.27,106.68 1.27,105.41 1.27,104.14
  pour Bottom: 48.26,152.4 0,152.4 0,0 48.26,0
  pour Top: 48.26,0 0,0 0,152.4 48.26,152.4
N$1
  Bottom 0.254: R17.1 R16.2 5.69,72.17 C18.2 5.95,72.39 IC3.8
N$2
  Bottom 0.508: 36.54,77.8 IC1.3
  Bottom 1.016: IC1.3 40,78.06 40,80.65 40.64,81.28 C6.1 | L1.1 36.54,77.8
N$3
  Bottom 0.254: IC7.6 29.29,111.76 C10.1 29.77,111.76 R3.1 31.54,112.81 31.75,113.03 35.66,113.03 R4.2
N$4
  Bottom 0.254: CVIN1.1 CV1.P$1 6.67,52.39 5.71,53.34 R18.1
N$5
  Top 0.254: TRIG4.P$1 TR4.1
  Bottom 0.254: R39.1 42.76,103.29 41.27,104.78 TR4.1
N$6
  Bottom 0.254: IC7.7 29.29,110.49 C10.2 29.6,110.17 31.22,110.17 R2.1
N$7
  Bottom 0.254: IC7.9 18.97,111.76 | 18.97,111.76 C11.1 | 18.97,111.76 R6.1 16.72,112.81 16.51,113.03 12.6,113.03 R7.2
N$8
  Bottom 0.254: R9.2 R8.2 36.2,118.75 36.83,119.38 A.P$1 | 36.83,124.46 A.P$1 | A.P$1 CV_A.1
N$9
  Bottom 0.254: 5.74,73.88 C18.1 | R16.1 5.74,73.88 | 5.74,73.88 5.95,73.66 7.62,73.66 IC3.9 9.52,73.66 10.16,73.03 10.16,71.75 9.52,71.12 7.62,71.12 5.71,69.22 R18.2 R19.2
N$10
  Bottom 0.254: IC7.8 18.97,110.49 C11.2 18.66,110.17 17.04,110.17 R5.1
N$11
  Bottom 0.254: TR1.1 TRIG1.P$1 41.17,52.39 42.76,50.8 R33.1
N$12
  Bottom 0.254: IC7.2 28.57,116.84 29.29,116.84 | 29.29,116.84 C12.1 | R10.2 35.66,115.57 31.75,115.57 31.54,115.78 R9.1 29.29,116.84
N$15
  Bottom 0.254: R22.1 11.64,66.46 CV2.P$1 CVIN2.1
N$16
  Bottom 0.254: IC7.1 29.29,118.11 C12.2 29.6,118.43 31.22,118.43 R8.1
N$17
  Bottom 0.254: R23.2 R22.2 17.14,69.22 15.24,71.12 13.33,71.12 12.7,71.75 12.7,73.03 13.33,73.66 IC3.6 16.91,73.66 C19.1 17.17,73.88 R20.1
N$18
  Bottom 0.254: C13.1 18.97,116.84 | 18.97,116.84 IC7.13 | 18.97,116.84 R12.1 16.72,115.78 16.51,115.57 12.6,115.57 R13.2
N$19
  Bottom 0.254: CV_C.1 C.P$1 45.08,142.88 46.99,140.97 46.99,111.12 45.72,109.86 R2.2 R3.2
N$20
  Bottom 0.254: IC3.7 16.91,72.39 C19.2 17.17,72.17 17.78,72.17 R20.2 20.75,72.17 R21.1
N$21
  Bottom 0.254: IC7.14 18.97,118.11 C13.2 18.66,118.43 17.04,118.43 R11.1
N$22
  Bottom 0.254: DOWNSW.3 40.96,19.33 | 40.96,19.33 DOWNSW.4 | R42.1 40.96,19.33
N$23
  Bottom 0.254: CVIN3.1 CV3.P$1 16.61,85.73 R26.1
N$24
  Bottom 0.254: R24.1 16.85,78.53 C20.1 16.59,78.74 IC3.2 13.33,78.74 12.7,79.38 12.7,80.65 13.33,81.28 15.24,81.28 16.83,82.87 R26.2 R27.2
N$25
  Bottom 0.254: IC3.1 16.59,80.01 C20.2 18.71,80.25 R24.2 R25.1
N$26
  Bottom 0.254: UPSW.4 40.96,9.25 | 40.96,9.25 UPSW.3 | R41.1 40.96,9.25
N$27  (via drill 0.51)
  Top 0.254: v6.35,87.63 6.35,103.19 CVIN4.1
  Bottom 0.254: CV4.P$1 CVIN4.1 | R30.1 5.71,87 v6.35,87.63
N$28
  Bottom 0.254: R31.2 R30.2 5.71,83.19 7.62,81.28 9.52,81.28 10.16,80.65 10.16,79.38 9.52,78.74 IC3.13 5.95,78.74 C21.1 5.69,78.53 R28.1
N$29
  Bottom 0.254: IC3.14 5.95,80.01 C21.2 5.69,80.23 R28.2 R29.1
N$30
  Top 0.254: CV_B.1 B.P$1
  Bottom 0.254: CV_B.1 B.P$1 11.43,119.38 12.06,118.75 R11.2 R12.2
N$31
  Bottom 0.254: R35.1 42.76,66.14 42.23,66.67 TR2.1 TRIG2.P$1
N$32
  Top 0.254: D.P$1 CV_D.1
  Bottom 0.254: R6.2 R5.2 2.54,109.86 1.27,111.12 1.27,140.97 3.18,142.88 D.P$1
N$33
  Bottom 0.254: T3.B 38.09,93.19 40.3,93.19 D2.C 41.06,92.75 R38.2 R37.2
N$34
  Bottom 0.254: R37.1 42.76,87.21 41.27,85.73 TR3.1 TRIG3.P$1
N$38
  Bottom 0.254: D1.C 41.06,97.75 R40.2 | R40.2 R39.2 | T4.B 38.24,99.06 R40.2
N$40
  Bottom 0.254: T2.B 38.88,62.23 R35.2 R36.2 41.06,59.02 D3.C
N$41
  Bottom 0.254: T1.B 38.24,46.36 40.74,46.36 R34.2 | D4.C 41.06,44.73 R34.2 | R33.2 R34.2
N$196
  Bottom 0.508: D11.C 14.47,151.13 18.1,151.13 | 18.1,151.13 J3.4 18.19,149 J2.4 18.19,151.04 18.1,151.13
N$263
  Bottom 0.508: 30.16,151.13 J3.1 30.07,149 J2.1 30.07,151.04 30.16,151.13 | 30.16,151.13 33.79,151.13 D9.A
OFFSET  (via drill 0.51)
  Top 0.508: v3.81,64.77 v3.81,87.63 v3.81,130.81
  Bottom 0.508: R32.1 7.72,133.67 10.33,133.67 IC5.2 10.48,130.86 C22.1 v3.81,130.81 | R31.1 v3.81,87.63 3.81,88.9 6.35,91.44 16.19,91.44 18.73,88.9 R27.1 18.95,85.73 20.95,85.73 24.29,82.39 24.29,70.01 20.95,66.67 19.27,66.67 R23.1 | R19.1 v3.81,64.77
POGO  (via drill 0.89)
  Bottom 0.508: R43.1 6.03,16.61 | R43.1 5.93,14.62 U1.2 | R43.1 v29.21,16.51
RST
  Top 0.254: JP1.5 16.51,5.08 15.24,6.35 TEENSY3.2.7
RST_DAC  (via drill 0.51)
  Top 0.254: v23.81,88.9 21.59,88.9 19.05,86.36 19.05,41.28 21.59,38.73 21.59,22.23 20.95,21.59 11.43,21.59 10.16,20.32 TEENSY3.2.9
  Bottom 0.254: DAC.13 23.8,88.91 v23.81,88.9
SCK  (via drill 0.51)
  Top 0.254: v26.67,88.9 v26.67,50.17
  Top 0.508: JP1.3 v21.59,19.05
  Bottom 0.254: DAC.10 25.76,89.81 v26.67,88.9 | v26.67,50.17 19.68,50.17 15.87,46.36 3.81,46.36 2.54,45.09 TEENSY3.2.13
  Bottom 0.508: TEENSY3.2.13 2.54,20.32 3.81,19.05 v21.59,19.05
SW_B
  Bottom 0.254: C24.1 42.84,16.3 R42.2 40.96,13.02 39.37,11.43 24.13,11.43 22.86,10.16 TEENSY3.2.4
SW_L
  Bottom 0.254: C17.1 46.36,32.86 45.92,32.43 SW_L.E 43.35,31.95 43.35,24.3 41.12,22.07 28.73,22.07 27.94,22.86 TEENSY3.2.23/A9
SW_R
  Bottom 0.254: TEENSY3.2.14/A0 5.08,29.21 6.35,30.48 6.35,36.83 5.75,37.43 SW_R.E
SW_T
  Bottom 0.254: C25.2 40.98,6.27 R41.2 39.74,6.29 39.37,6.67 21.27,6.67 20.32,7.62 TEENSY3.2.5
TR1  (via drill 0.51)
  Top 0.254: TEENSY3.2.0 33.02,10.16 34.29,11.43 45.72,11.43 46.99,12.7 v46.99,42.55
  Bottom 0.254: v46.99,42.55 37.47,42.55 35.73,44.28 T1.C
TR2  (via drill 0.51)
  Top 0.254: TEENSY3.2.1 30.48,10.16 32.7,12.38 42.86,12.38 43.34,12.86 43.34,25.72 45.72,28.1 v45.72,57.15
  Bottom 0.254: v45.72,57.15 36.83,57.15 35.73,58.25 T2.C
TR3  (via drill 0.51)
  Top 0.254: TEENSY3.2.2 27.94,10.16 31.11,13.34 40.64,13.34 41.91,14.61 41.91,39.37 44.45,41.91 44.45,93.98 v43.18,95.25
  Bottom 0.254: T3.C 35.73,94.15 36.83,95.25 v43.18,95.25
TR4  (via drill 0.51)
  Top 0.254: TEENSY3.2.3 25.4,10.16 29.53,14.29 40,14.29 40.8,15.08 40.8,39.53 43.18,41.91 43.18,92.71 37.47,98.43 v33.02,98.43
  Bottom 0.254: v33.02,98.43 T4.C
V_BIAS
  Bottom 0.254: 23.81,115.57 24.13,115.57 | IC7.5 24.45,113.03 | IC7.10 23.81,113.03 | 23.81,113.03 23.97,113.19 | 23.97,113.19 24.13,113.35 | IC7.12 23.81,115.57 | IC7.3 24.45,115.57 | 24.45,115.57 24.13,115.57 | 24.13,115.57 24.13,115.25 | 24.13,115.25 24.45,115.57 | 24.13,113.35 24.13,115.25 | 24.13,115.25 23.81,115.57 | 23.81,113.03 24.45,113.03 | 24.45,113.03 24.13,113.35 | C16.1 20.34,108.17 R15.2 R14.1 24.13,111.76 24.13,112.71 | 24.13,112.71 24.13,113.03 23.97,113.19 | 24.13,112.71 23.81,113.03 | 24.13,112.71 24.45,113.03
VREF_2V5
  Bottom 0.254: C14.1 C15.1 26.01,106.47 R14.2 24.13,99.06 23.16,98.09 DAC.3

### Text on the board
tNames: CS | DC | Rst | D1 | D0 | 3v3 | Gnd
bNames: POGO | pogo pin: 0.85mm
guidelines: D | C | B | A | out | 4 | 3 | 2 | 1 | trig | in | OC | LW